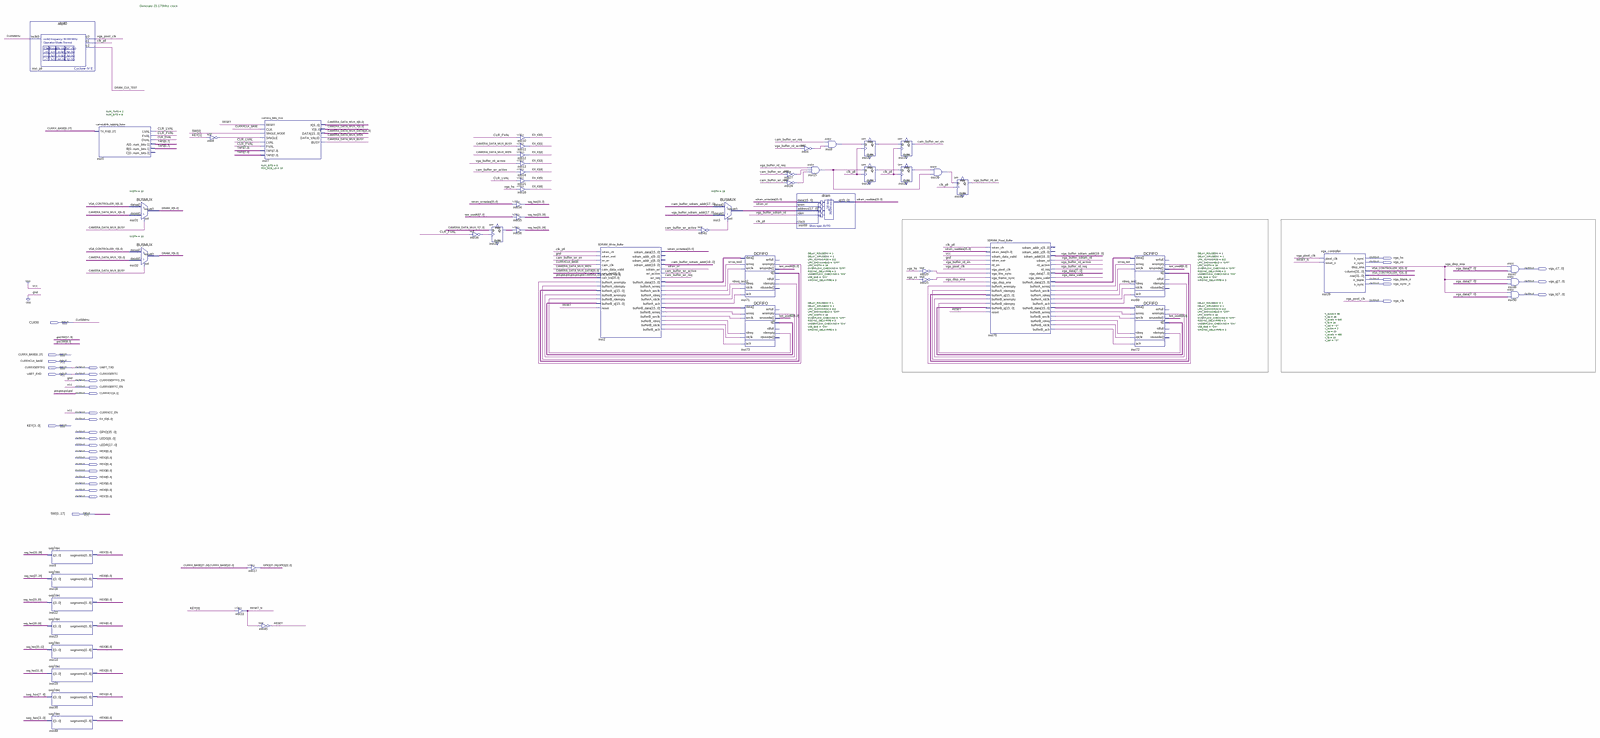
[diagram p0: schematic sheet, whole]
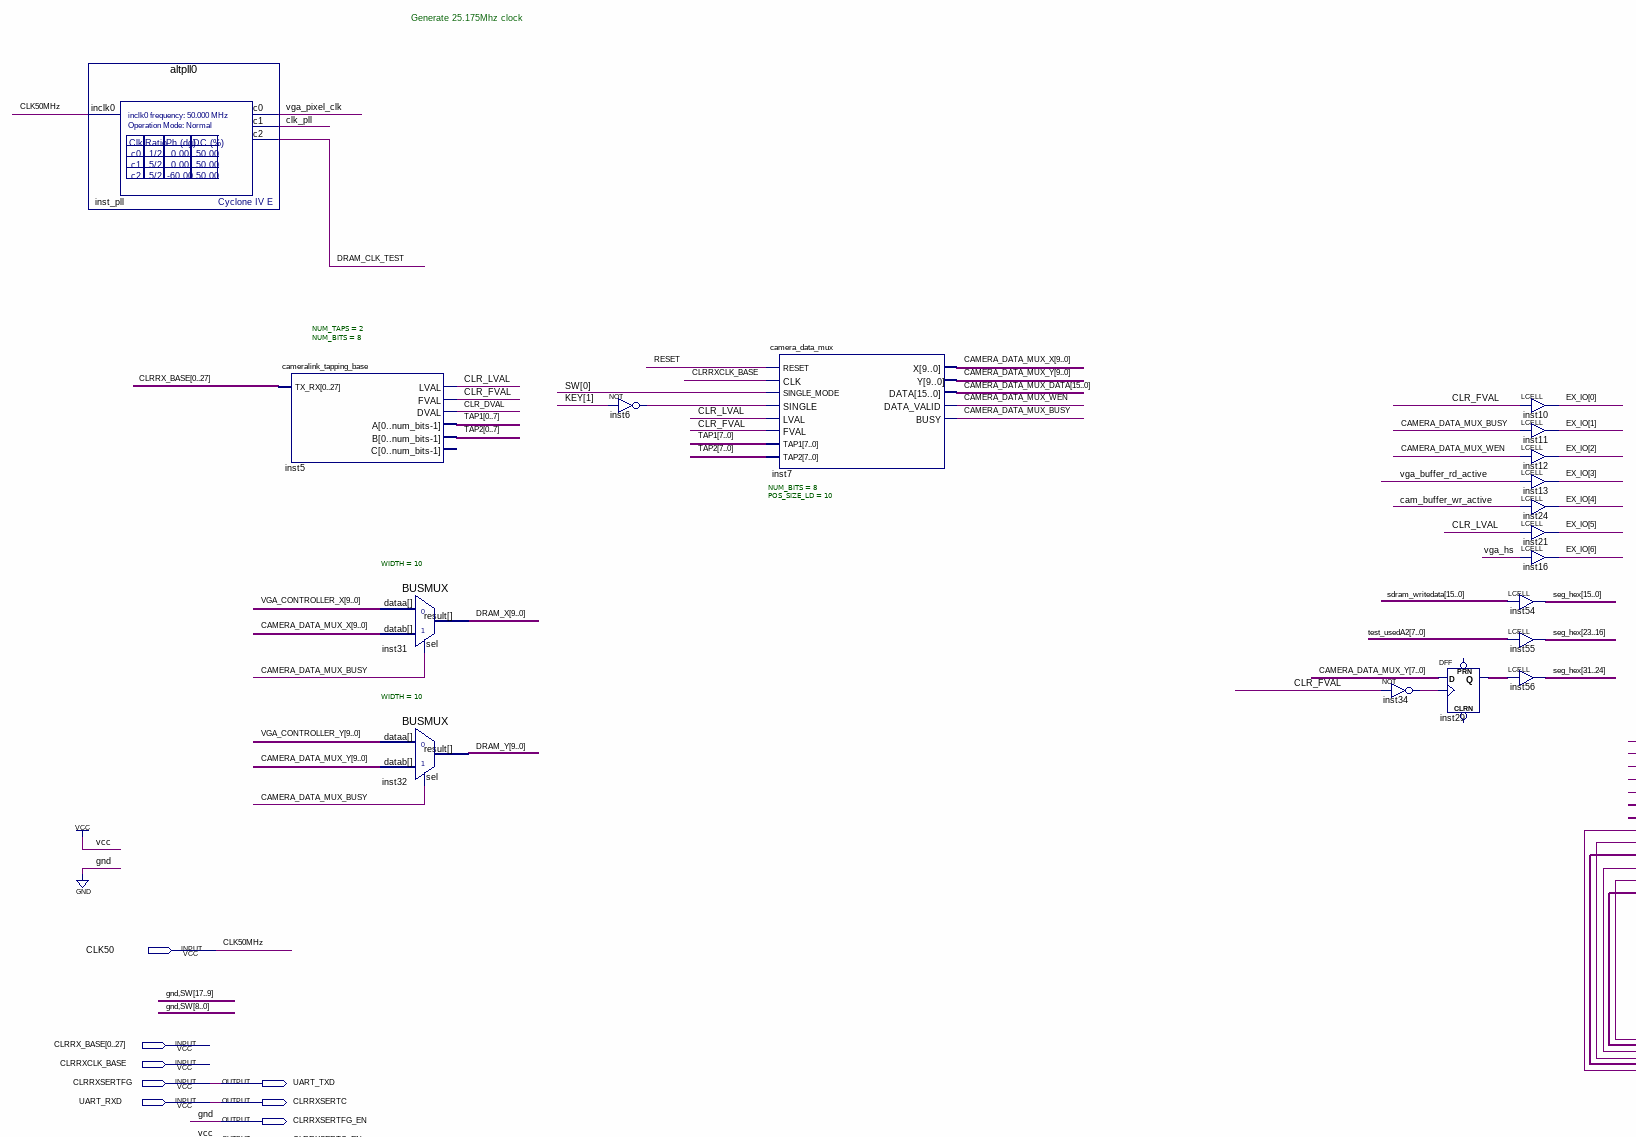
[diagram p1: schematic sheet, upper left part]
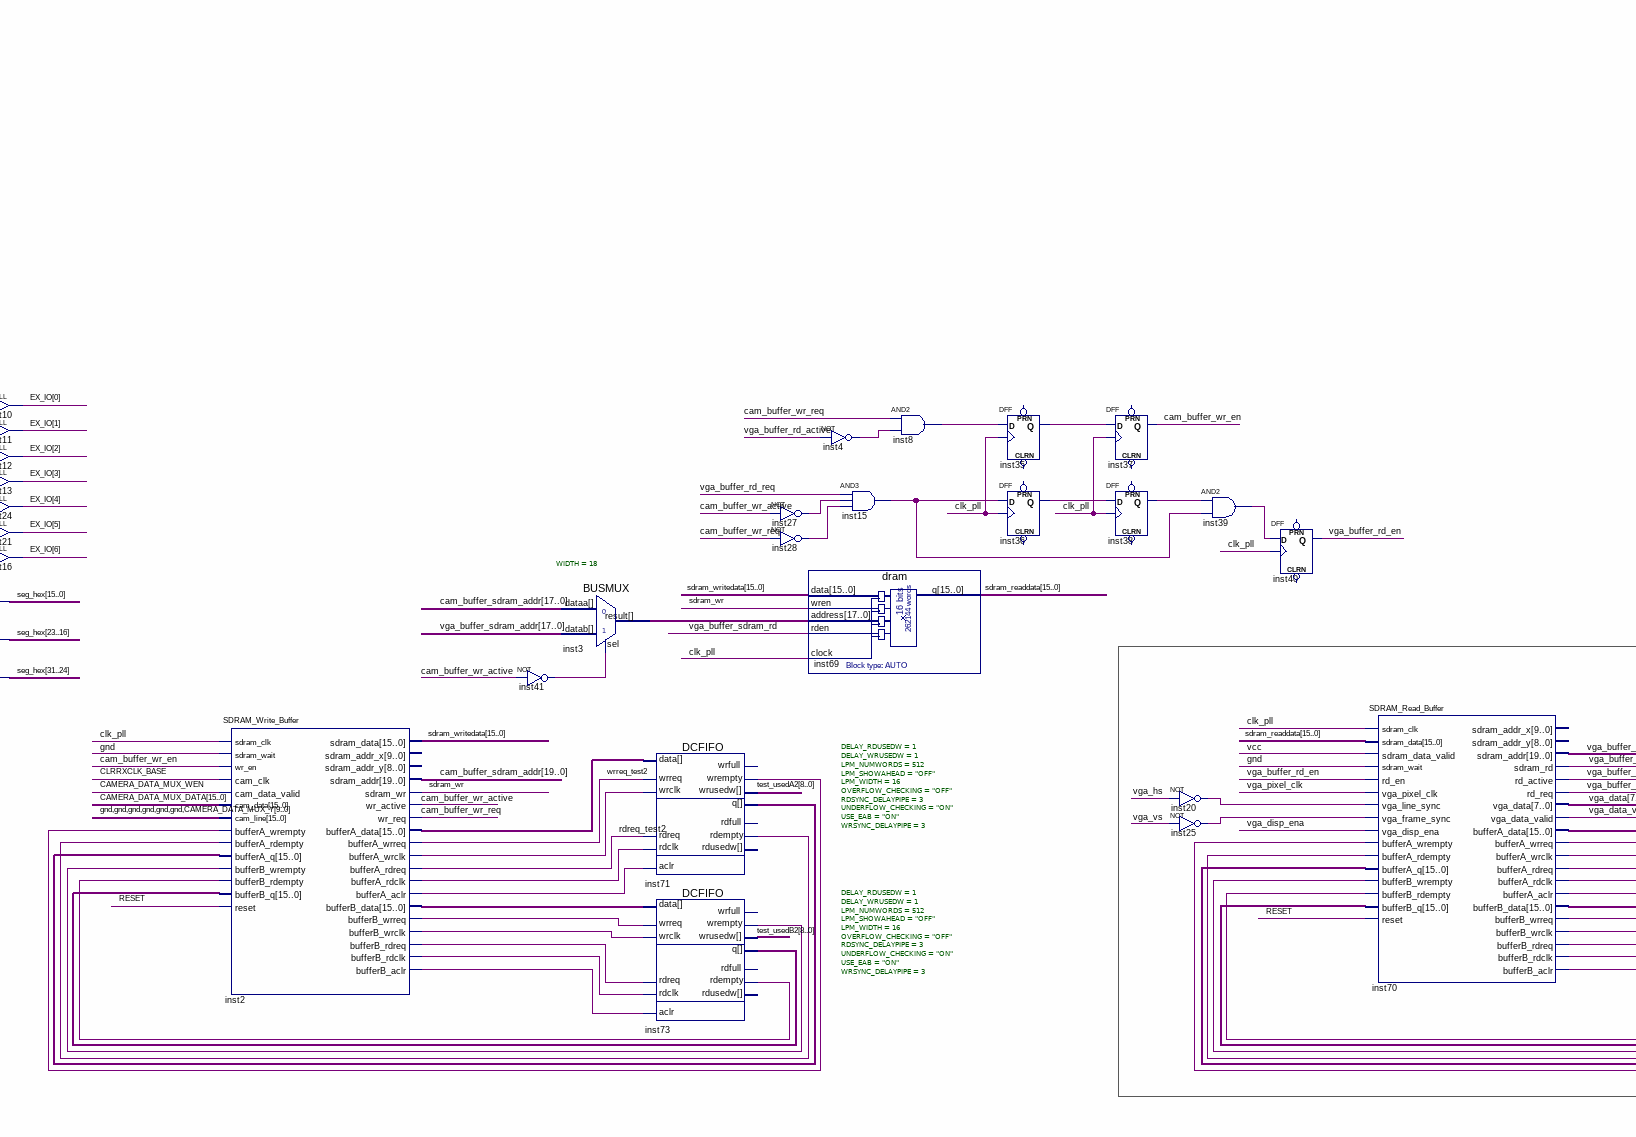
[diagram p2: schematic sheet, upper centre part]
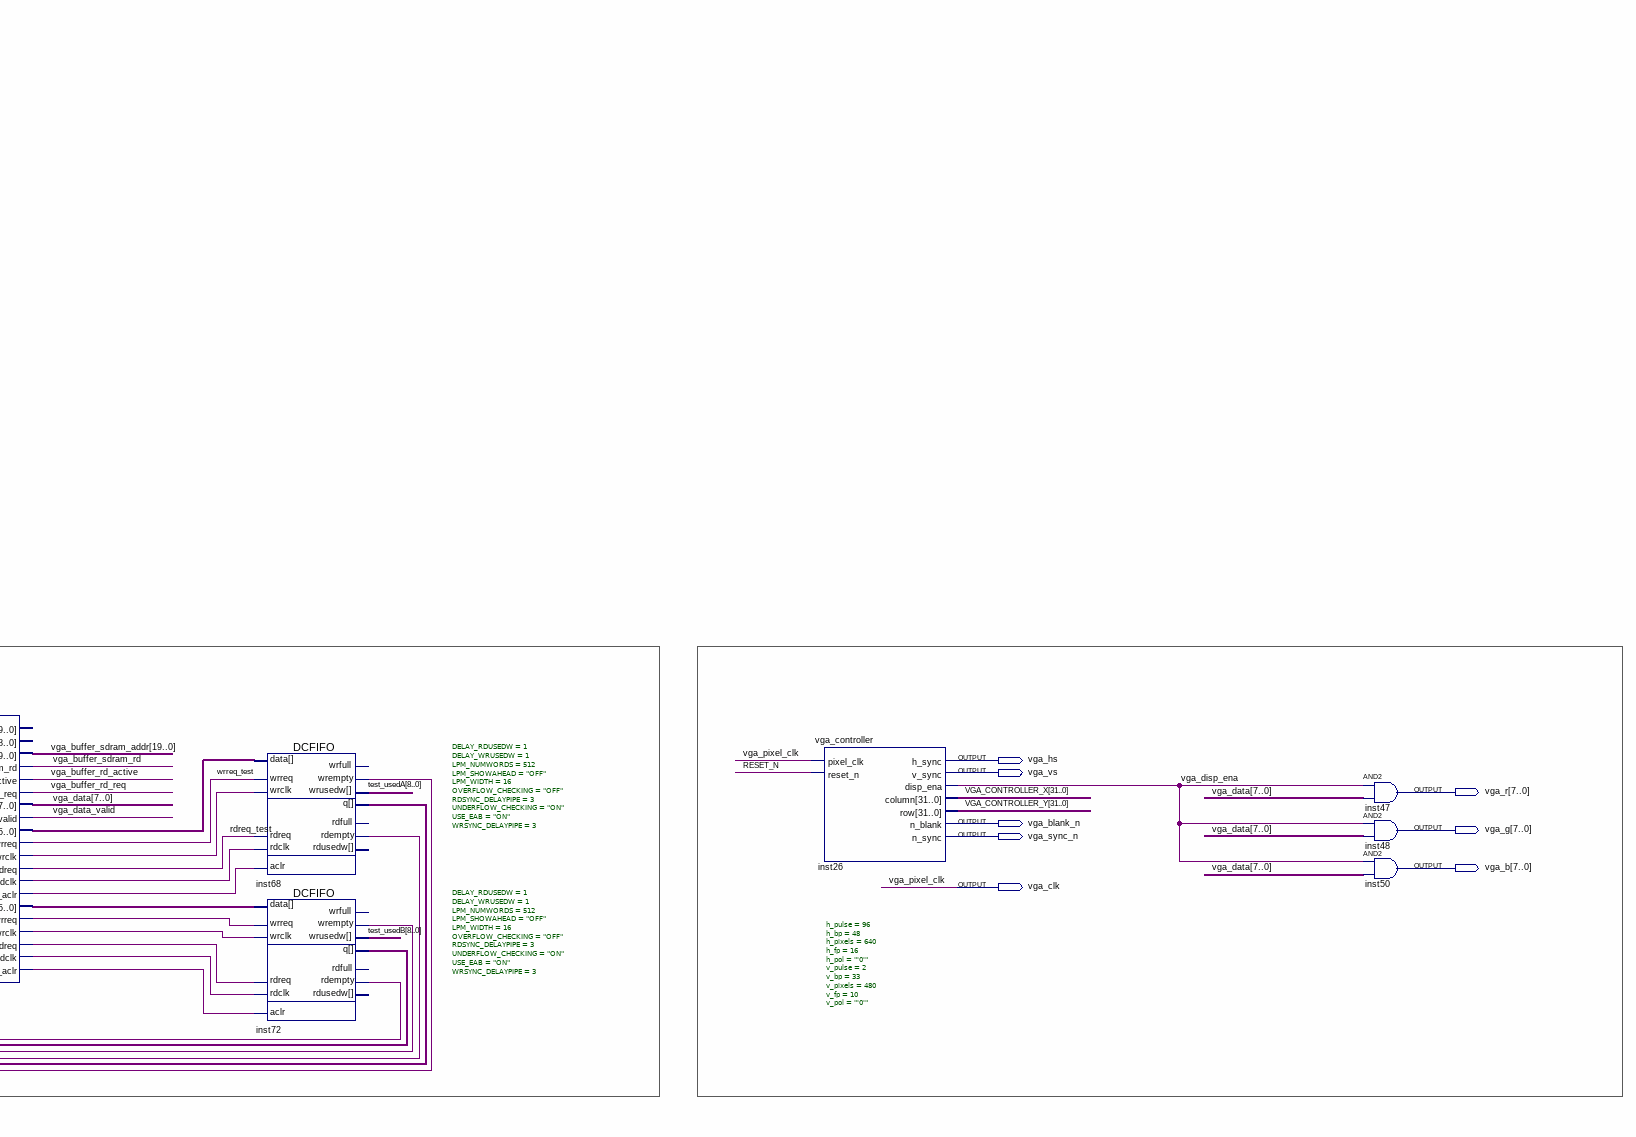
[diagram p3: schematic sheet, upper right part]
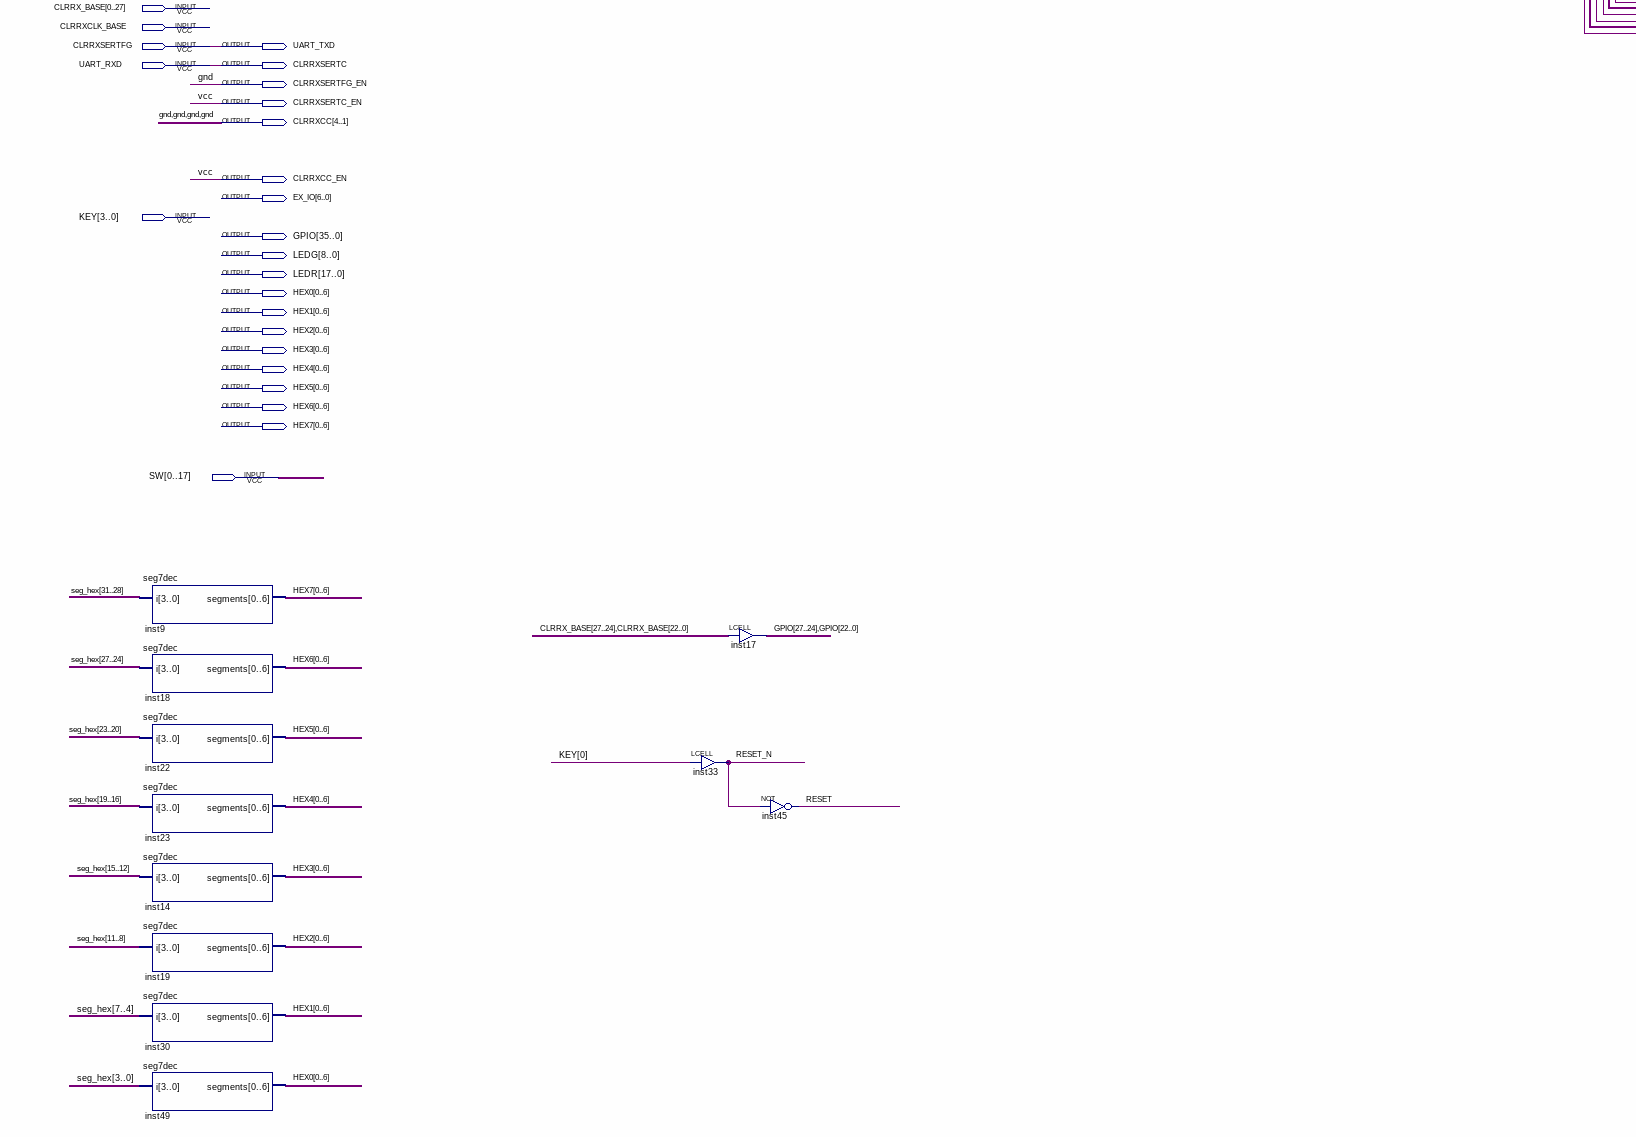
[diagram p4: schematic sheet, lower left part]
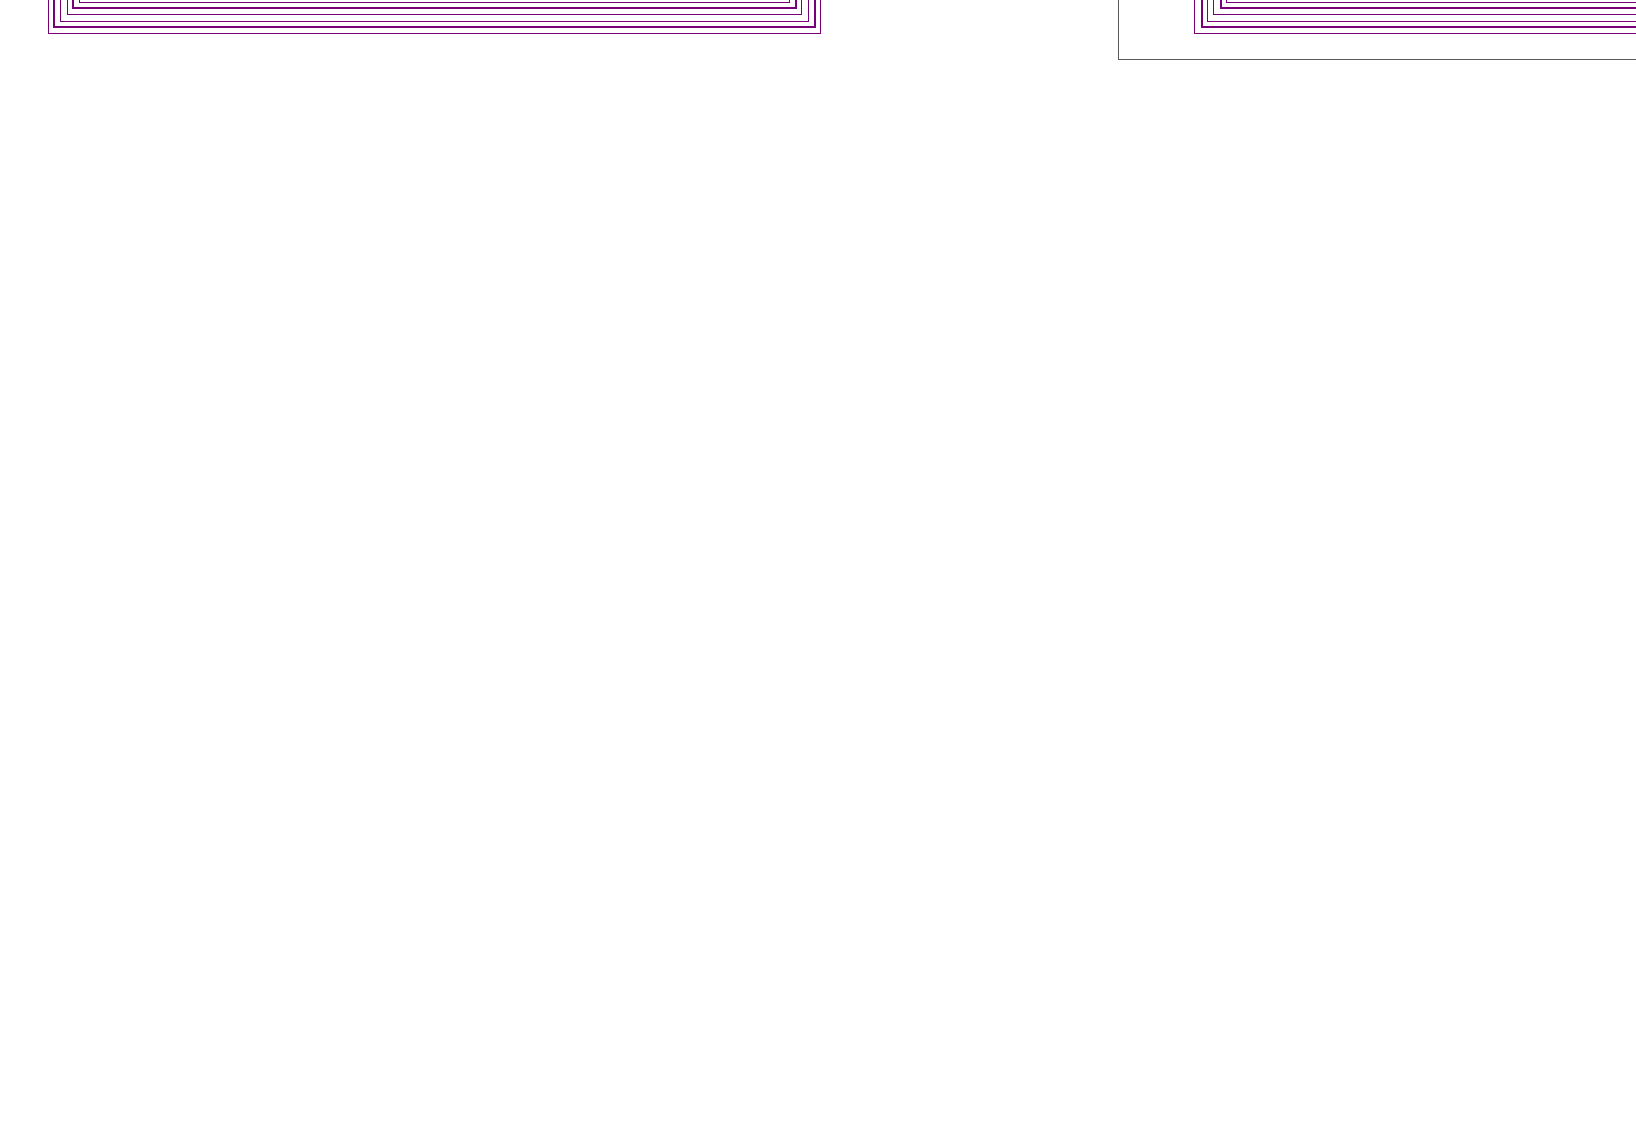
[diagram p5: schematic sheet, lower centre part]
// Quartus schematic sdram-read-buffer-fifo-test.bdf as structural Verilog: 55 symbols, 33 pins
module \sdram-read-buffer-fifo-test  (
  input  CLK50,
  input  [0:27] CLRRX_BASE,
  input  CLRRXCLK_BASE,
  input  CLRRXSERTFG,
  input  UART_RXD,
  input  [3:0] KEY,
  input  [0:17] SW,
  output vga_hs,
  output vga_vs,
  output [7:0] vga_r,
  output vga_blank_n,
  output [7:0] vga_g,
  output vga_sync_n,
  output [7:0] vga_b,
  output vga_clk,
  output UART_TXD,
  output CLRRXSERTC,
  output CLRRXSERTFG_EN,
  output CLRRXSERTC_EN,
  output [4:1] CLRRXCC,
  output CLRRXCC_EN,
  output [6:0] EX_IO,
  output [35:0] GPIO,
  output [8:0] LEDG,
  output [17:0] LEDR,
  output [0:6] HEX0,
  output [0:6] HEX1,
  output [0:6] HEX2,
  output [0:6] HEX3,
  output [0:6] HEX4,
  output [0:6] HEX5,
  output [0:6] HEX6,
  output [0:6] HEX7
);

  wire cam_buffer_wr_active, cam_buffer_wr_en, cam_buffer_wr_req, CAMERA_DATA_MUX_BUSY, CAMERA_DATA_MUX_WEN,
       clk_pll, CLR_DVAL, CLR_FVAL, CLR_LVAL, DRAM_CLK_TEST, inst2_buffera_aclr, inst2_buffera_rdclk,
       inst2_buffera_wrclk, inst2_bufferb_aclr, inst2_bufferb_rdclk, inst2_bufferb_rdreq,
       inst2_bufferb_wrclk, inst2_bufferb_wrreq, inst4_out, inst6_out, inst8_out, inst15_out, inst20_out,
       inst25_out, inst27_out, inst28_out, inst34_out, inst35_q, inst36_q, inst38_q, inst39_out, inst41_out,
       inst68_rdempty, inst68_wrempty, inst70_buffera_aclr, inst70_buffera_rdclk, inst70_buffera_wrclk,
       inst70_bufferb_aclr, inst70_bufferb_rdclk, inst70_bufferb_rdreq, inst70_bufferb_wrclk,
       inst70_bufferb_wrreq, inst71_rdempty, inst71_wrempty, inst72_rdempty, inst72_wrempty, inst73_rdempty,
       inst73_wrempty, rdreq_test, rdreq_test2, RESET, RESET_N, sdram_wr, vga_buffer_rd_active,
       vga_buffer_rd_en, vga_buffer_rd_req, vga_buffer_sdram_rd, vga_data_valid, vga_disp_ena, wrreq_test,
       wrreq_test2;
  wire [7:0] inst29_q, TAP1, TAP2, vga_data;
  wire [8:0] test_usedA, test_usedA2, test_usedB, test_usedB2;
  wire [9:0] CAMERA_DATA_MUX_X, CAMERA_DATA_MUX_Y, DRAM_X, DRAM_Y;
  wire [15:0] CAMERA_DATA_MUX_DATA, inst2_buffera_data, inst2_bufferb_data, inst68_q, inst70_buffera_data,
       inst70_bufferb_data, inst71_q, inst72_q, inst73_q, sdram_readdata, sdram_writedata;
  wire [17:0] inst3_result;
  wire [19:0] cam_buffer_sdram_addr, vga_buffer_sdram_addr;
  wire [31:0] seg_hex, VGA_CONTROLLER_X, VGA_CONTROLLER_Y;

  altpll0 inst_pll (.inclk0(CLK50), .c0(vga_clk), .c1(clk_pll), .c2(DRAM_CLK_TEST));
  seg7dec inst9 (.i(seg_hex[31:28]), .segments(HEX7));
  seg7dec inst18 (.i(seg_hex[27:24]), .segments(HEX6));
  seg7dec inst22 (.i(seg_hex[23:20]), .segments(HEX5));
  seg7dec inst23 (.i(seg_hex[19:16]), .segments(HEX4));
  seg7dec inst14 (.i(seg_hex[15:12]), .segments(HEX3));
  seg7dec inst19 (.i(seg_hex[11:8]), .segments(HEX2));
  seg7dec inst30 (.i(seg_hex[7:4]), .segments(HEX1));
  seg7dec inst49 (.i(seg_hex[3:0]), .segments(HEX0));
  cameralink_tapping_base #(.NUM_TAPS(2), .NUM_BITS(8)) inst5 (
    .TX_RX(CLRRX_BASE), .LVAL(CLR_LVAL), .FVAL(CLR_FVAL), .DVAL(CLR_DVAL),
    .A({TAP1[0], TAP1[1], TAP1[2], TAP1[3], TAP1[4], TAP1[5], TAP1[6], TAP1[7]}),
    .B({TAP2[0], TAP2[1], TAP2[2], TAP2[3], TAP2[4], TAP2[5], TAP2[6], TAP2[7]}));  // open: C
  BUSMUX #(.WIDTH(10)) inst31 (
    .datab(CAMERA_DATA_MUX_X), .sel(CAMERA_DATA_MUX_BUSY), .dataa(VGA_CONTROLLER_X[9:0]), .result(DRAM_X));
  BUSMUX #(.WIDTH(10)) inst32 (
    .datab(CAMERA_DATA_MUX_Y), .sel(CAMERA_DATA_MUX_BUSY), .dataa(VGA_CONTROLLER_Y[9:0]), .result(DRAM_Y));
  not inst6 (inst6_out, KEY[1]);
  LCELL inst33 (.IN(KEY[0]), .OUT(RESET_N));
  camera_data_mux #(.NUM_BITS(8), .POS_SIZE_LD(10)) inst7 (
    .RESET(RESET), .CLK(CLRRXCLK_BASE), .SINGLE_MODE(SW[0]), .SINGLE(inst6_out), .LVAL(CLR_LVAL),
    .FVAL(CLR_FVAL), .TAP1(TAP1), .TAP2(TAP2), .X(CAMERA_DATA_MUX_X), .Y(CAMERA_DATA_MUX_Y),
    .DATA(CAMERA_DATA_MUX_DATA), .DATA_VALID(CAMERA_DATA_MUX_WEN), .BUSY(CAMERA_DATA_MUX_BUSY));
  LCELL inst17[26:0] (
    .IN({CLRRX_BASE[27], CLRRX_BASE[26], CLRRX_BASE[25], CLRRX_BASE[24], CLRRX_BASE[22], CLRRX_BASE[21], CLRRX_BASE[20], CLRRX_BASE[19], CLRRX_BASE[18], CLRRX_BASE[17], CLRRX_BASE[16], CLRRX_BASE[15], CLRRX_BASE[14], CLRRX_BASE[13], CLRRX_BASE[12], CLRRX_BASE[11], CLRRX_BASE[10], CLRRX_BASE[9], CLRRX_BASE[8], CLRRX_BASE[7], CLRRX_BASE[6], CLRRX_BASE[5], CLRRX_BASE[4], CLRRX_BASE[3], CLRRX_BASE[2], CLRRX_BASE[1], CLRRX_BASE[0]}),
    .OUT({GPIO[27:24], GPIO[22:0]}));
  not inst45 (RESET, RESET_N);
  not inst34 (inst34_out, CLR_FVAL);
  DFF inst29[7:0] (.CLK(inst34_out), .D(CAMERA_DATA_MUX_Y[7:0]), .Q(inst29_q));  // open: CLRN, PRN
  LCELL inst10 (.IN(CLR_FVAL), .OUT(EX_IO[0]));
  LCELL inst11 (.IN(CAMERA_DATA_MUX_BUSY), .OUT(EX_IO[1]));
  LCELL inst12 (.IN(CAMERA_DATA_MUX_WEN), .OUT(EX_IO[2]));
  LCELL inst13 (.IN(vga_buffer_rd_active), .OUT(EX_IO[3]));
  LCELL inst24 (.IN(cam_buffer_wr_active), .OUT(EX_IO[4]));
  LCELL inst21 (.IN(CLR_LVAL), .OUT(EX_IO[5]));
  LCELL inst16 (.IN(vga_hs), .OUT(EX_IO[6]));
  LCELL inst54[15:0] (.IN(sdram_writedata), .OUT(seg_hex[15:0]));
  LCELL inst55[7:0] (.IN(test_usedA2[7:0]), .OUT(seg_hex[23:16]));
  LCELL inst56[7:0] (.IN(inst29_q), .OUT(seg_hex[31:24]));
  SDRAM_Write_Buffer inst2 (
    .sdram_clk(clk_pll), .sdram_wait(1'b0), .wr_en(cam_buffer_wr_en), .cam_clk(CLRRXCLK_BASE),
    .cam_data_valid(CAMERA_DATA_MUX_WEN), .cam_data(CAMERA_DATA_MUX_DATA),
    .cam_line({{6{1'b0}}, CAMERA_DATA_MUX_Y}), .bufferA_wrempty(inst71_wrempty),
    .bufferA_rdempty(inst71_rdempty), .bufferA_q(inst71_q), .bufferB_wrempty(inst73_wrempty),
    .bufferB_rdempty(inst73_rdempty), .bufferB_q(inst73_q), .reset(RESET), .sdram_data(sdram_writedata),
    .sdram_addr(cam_buffer_sdram_addr), .sdram_wr(sdram_wr), .wr_active(cam_buffer_wr_active),
    .wr_req(cam_buffer_wr_req), .bufferA_data(inst2_buffera_data), .bufferA_wrreq(wrreq_test2),
    .bufferA_wrclk(inst2_buffera_wrclk), .bufferA_rdreq(rdreq_test2), .bufferA_rdclk(inst2_buffera_rdclk),
    .bufferA_aclr(inst2_buffera_aclr), .bufferB_data(inst2_bufferb_data),
    .bufferB_wrreq(inst2_bufferb_wrreq), .bufferB_wrclk(inst2_bufferb_wrclk),
    .bufferB_rdreq(inst2_bufferb_rdreq), .bufferB_rdclk(inst2_bufferb_rdclk),
    .bufferB_aclr(inst2_bufferb_aclr));  // open: sdram_addr_x, sdram_addr_y
  not inst41 (inst41_out, cam_buffer_wr_active);
  BUSMUX #(.WIDTH(18)) inst3 (
    .datab(vga_buffer_sdram_addr[17:0]), .sel(inst41_out), .dataa(cam_buffer_sdram_addr[17:0]),
    .result(inst3_result));
  DCFIFO #(.DELAY_RDUSEDW(1), .DELAY_WRUSEDW(1), .LPM_NUMWORDS(512), .LPM_SHOWAHEAD("OFF"), .LPM_WIDTH(16), .OVERFLOW_CHECKING("OFF"), .RDSYNC_DELAYPIPE(3), .UNDERFLOW_CHECKING("ON"), .USE_EAB("ON"), .WRSYNC_DELAYPIPE(3)) inst71 (
    .data(inst2_buffera_data), .wrclk(inst2_buffera_wrclk), .wrreq(wrreq_test2), .aclr(inst2_buffera_aclr),
    .rdclk(inst2_buffera_rdclk), .rdreq(rdreq_test2), .rdempty(inst71_rdempty), .wrempty(inst71_wrempty),
    .wrusedw(test_usedA2), .q(inst71_q));  // open: rdusedw, rdfull, wrfull
  DCFIFO #(.DELAY_RDUSEDW(1), .DELAY_WRUSEDW(1), .LPM_NUMWORDS(512), .LPM_SHOWAHEAD("OFF"), .LPM_WIDTH(16), .OVERFLOW_CHECKING("OFF"), .RDSYNC_DELAYPIPE(3), .UNDERFLOW_CHECKING("ON"), .USE_EAB("ON"), .WRSYNC_DELAYPIPE(3)) inst73 (
    .data(inst2_bufferb_data), .wrclk(inst2_bufferb_wrclk), .wrreq(inst2_bufferb_wrreq),
    .aclr(inst2_bufferb_aclr), .rdclk(inst2_bufferb_rdclk), .rdreq(inst2_bufferb_rdreq),
    .rdempty(inst73_rdempty), .wrempty(inst73_wrempty), .wrusedw(test_usedB2), .q(inst73_q));  // open: rdusedw, rdfull, wrfull
  not inst27 (inst27_out, cam_buffer_wr_active);
  not inst28 (inst28_out, cam_buffer_wr_req);
  dram inst69 (
    .data(sdram_writedata), .wren(sdram_wr), .address(inst3_result), .rden(vga_buffer_sdram_rd),
    .clock(clk_pll), .q(sdram_readdata));
  not inst4 (inst4_out, vga_buffer_rd_active);
  and inst15 (inst15_out, vga_buffer_rd_req, inst27_out, inst28_out);
  and inst8 (inst8_out, cam_buffer_wr_req, inst4_out);
  DFF inst35 (.CLK(clk_pll), .D(inst8_out), .Q(inst35_q));  // open: CLRN, PRN
  DFF inst36 (.CLK(clk_pll), .D(inst15_out), .Q(inst36_q));  // open: CLRN, PRN
  DFF inst37 (.CLK(clk_pll), .D(inst35_q), .Q(cam_buffer_wr_en));  // open: CLRN, PRN
  DFF inst38 (.CLK(clk_pll), .D(inst36_q), .Q(inst38_q));  // open: CLRN, PRN
  and inst39 (inst39_out, inst38_q, inst15_out);
  not inst20 (inst20_out, vga_hs);
  not inst25 (inst25_out, vga_vs);
  DFF inst40 (.CLK(clk_pll), .D(inst39_out), .Q(vga_buffer_rd_en));  // open: CLRN, PRN
  SDRAM_Read_Buffer inst70 (
    .sdram_clk(clk_pll), .sdram_data(sdram_readdata), .sdram_data_valid(1'b1), .sdram_wait(1'b0),
    .rd_en(vga_buffer_rd_en), .vga_pixel_clk(vga_clk), .vga_line_sync(inst20_out),
    .vga_frame_sync(inst25_out), .vga_disp_ena(vga_disp_ena), .bufferA_wrempty(inst68_wrempty),
    .bufferA_rdempty(inst68_rdempty), .bufferA_q(inst68_q), .bufferB_wrempty(inst72_wrempty),
    .bufferB_rdempty(inst72_rdempty), .bufferB_q(inst72_q), .reset(RESET),
    .sdram_addr(vga_buffer_sdram_addr), .sdram_rd(vga_buffer_sdram_rd), .rd_active(vga_buffer_rd_active),
    .rd_req(vga_buffer_rd_req), .vga_data(vga_data), .vga_data_valid(vga_data_valid),
    .bufferA_data(inst70_buffera_data), .bufferA_wrreq(wrreq_test), .bufferA_wrclk(inst70_buffera_wrclk),
    .bufferA_rdreq(rdreq_test), .bufferA_rdclk(inst70_buffera_rdclk), .bufferA_aclr(inst70_buffera_aclr),
    .bufferB_data(inst70_bufferb_data), .bufferB_wrreq(inst70_bufferb_wrreq),
    .bufferB_wrclk(inst70_bufferb_wrclk), .bufferB_rdreq(inst70_bufferb_rdreq),
    .bufferB_rdclk(inst70_bufferb_rdclk), .bufferB_aclr(inst70_bufferb_aclr));  // open: sdram_addr_x, sdram_addr_y
  DCFIFO #(.DELAY_RDUSEDW(1), .DELAY_WRUSEDW(1), .LPM_NUMWORDS(512), .LPM_SHOWAHEAD("OFF"), .LPM_WIDTH(16), .OVERFLOW_CHECKING("OFF"), .RDSYNC_DELAYPIPE(3), .UNDERFLOW_CHECKING("ON"), .USE_EAB("ON"), .WRSYNC_DELAYPIPE(3)) inst68 (
    .data(inst70_buffera_data), .wrclk(inst70_buffera_wrclk), .wrreq(wrreq_test), .aclr(inst70_buffera_aclr),
    .rdclk(inst70_buffera_rdclk), .rdreq(rdreq_test), .rdempty(inst68_rdempty), .wrempty(inst68_wrempty),
    .wrusedw(test_usedA), .q(inst68_q));  // open: rdusedw, rdfull, wrfull
  DCFIFO #(.DELAY_RDUSEDW(1), .DELAY_WRUSEDW(1), .LPM_NUMWORDS(512), .LPM_SHOWAHEAD("OFF"), .LPM_WIDTH(16), .OVERFLOW_CHECKING("OFF"), .RDSYNC_DELAYPIPE(3), .UNDERFLOW_CHECKING("ON"), .USE_EAB("ON"), .WRSYNC_DELAYPIPE(3)) inst72 (
    .data(inst70_bufferb_data), .wrclk(inst70_bufferb_wrclk), .wrreq(inst70_bufferb_wrreq),
    .aclr(inst70_bufferb_aclr), .rdclk(inst70_bufferb_rdclk), .rdreq(inst70_bufferb_rdreq),
    .rdempty(inst72_rdempty), .wrempty(inst72_wrempty), .wrusedw(test_usedB), .q(inst72_q));  // open: rdusedw, rdfull, wrfull
  vga_controller #(.h_pulse(96), .h_bp(48), .h_pixels(640), .h_fp(16), .h_pol("'0'"), .v_pulse(2), .v_bp(33), .v_pixels(480), .v_fp(10), .v_pol("'0'")) inst26 (
    .pixel_clk(vga_clk), .reset_n(RESET_N), .h_sync(vga_hs), .v_sync(vga_vs), .disp_ena(vga_disp_ena),
    .column(VGA_CONTROLLER_X), .row(VGA_CONTROLLER_Y), .n_blank(vga_blank_n), .n_sync(vga_sync_n));
  assign vga_r = {8{vga_disp_ena}} & vga_data;  // AND2 inst47, 8 bits wide
  assign vga_g = {8{vga_disp_ena}} & vga_data;  // AND2 inst48, 8 bits wide
  assign vga_b = {8{vga_disp_ena}} & vga_data;  // AND2 inst50, 8 bits wide

  assign CLRRXCC = 4'b0000;
  assign CLRRXCC_EN = 1'b1;
  assign CLRRXSERTC = UART_RXD;
  assign CLRRXSERTC_EN = 1'b1;
  assign CLRRXSERTFG_EN = 1'b0;
  assign UART_TXD = CLRRXSERTFG;

  // Other names for the same wires on the sheet: CLK50MHz = CLK50; vga_pixel_clk = vga_clk

  // Notes on the sheet:
  //   Generate 25.175Mhz clock
endmodule
